# EAGLE design pcb_univ_3-(2-7)-(5-0)-x-rev3 (EAGLE 7.4.0)
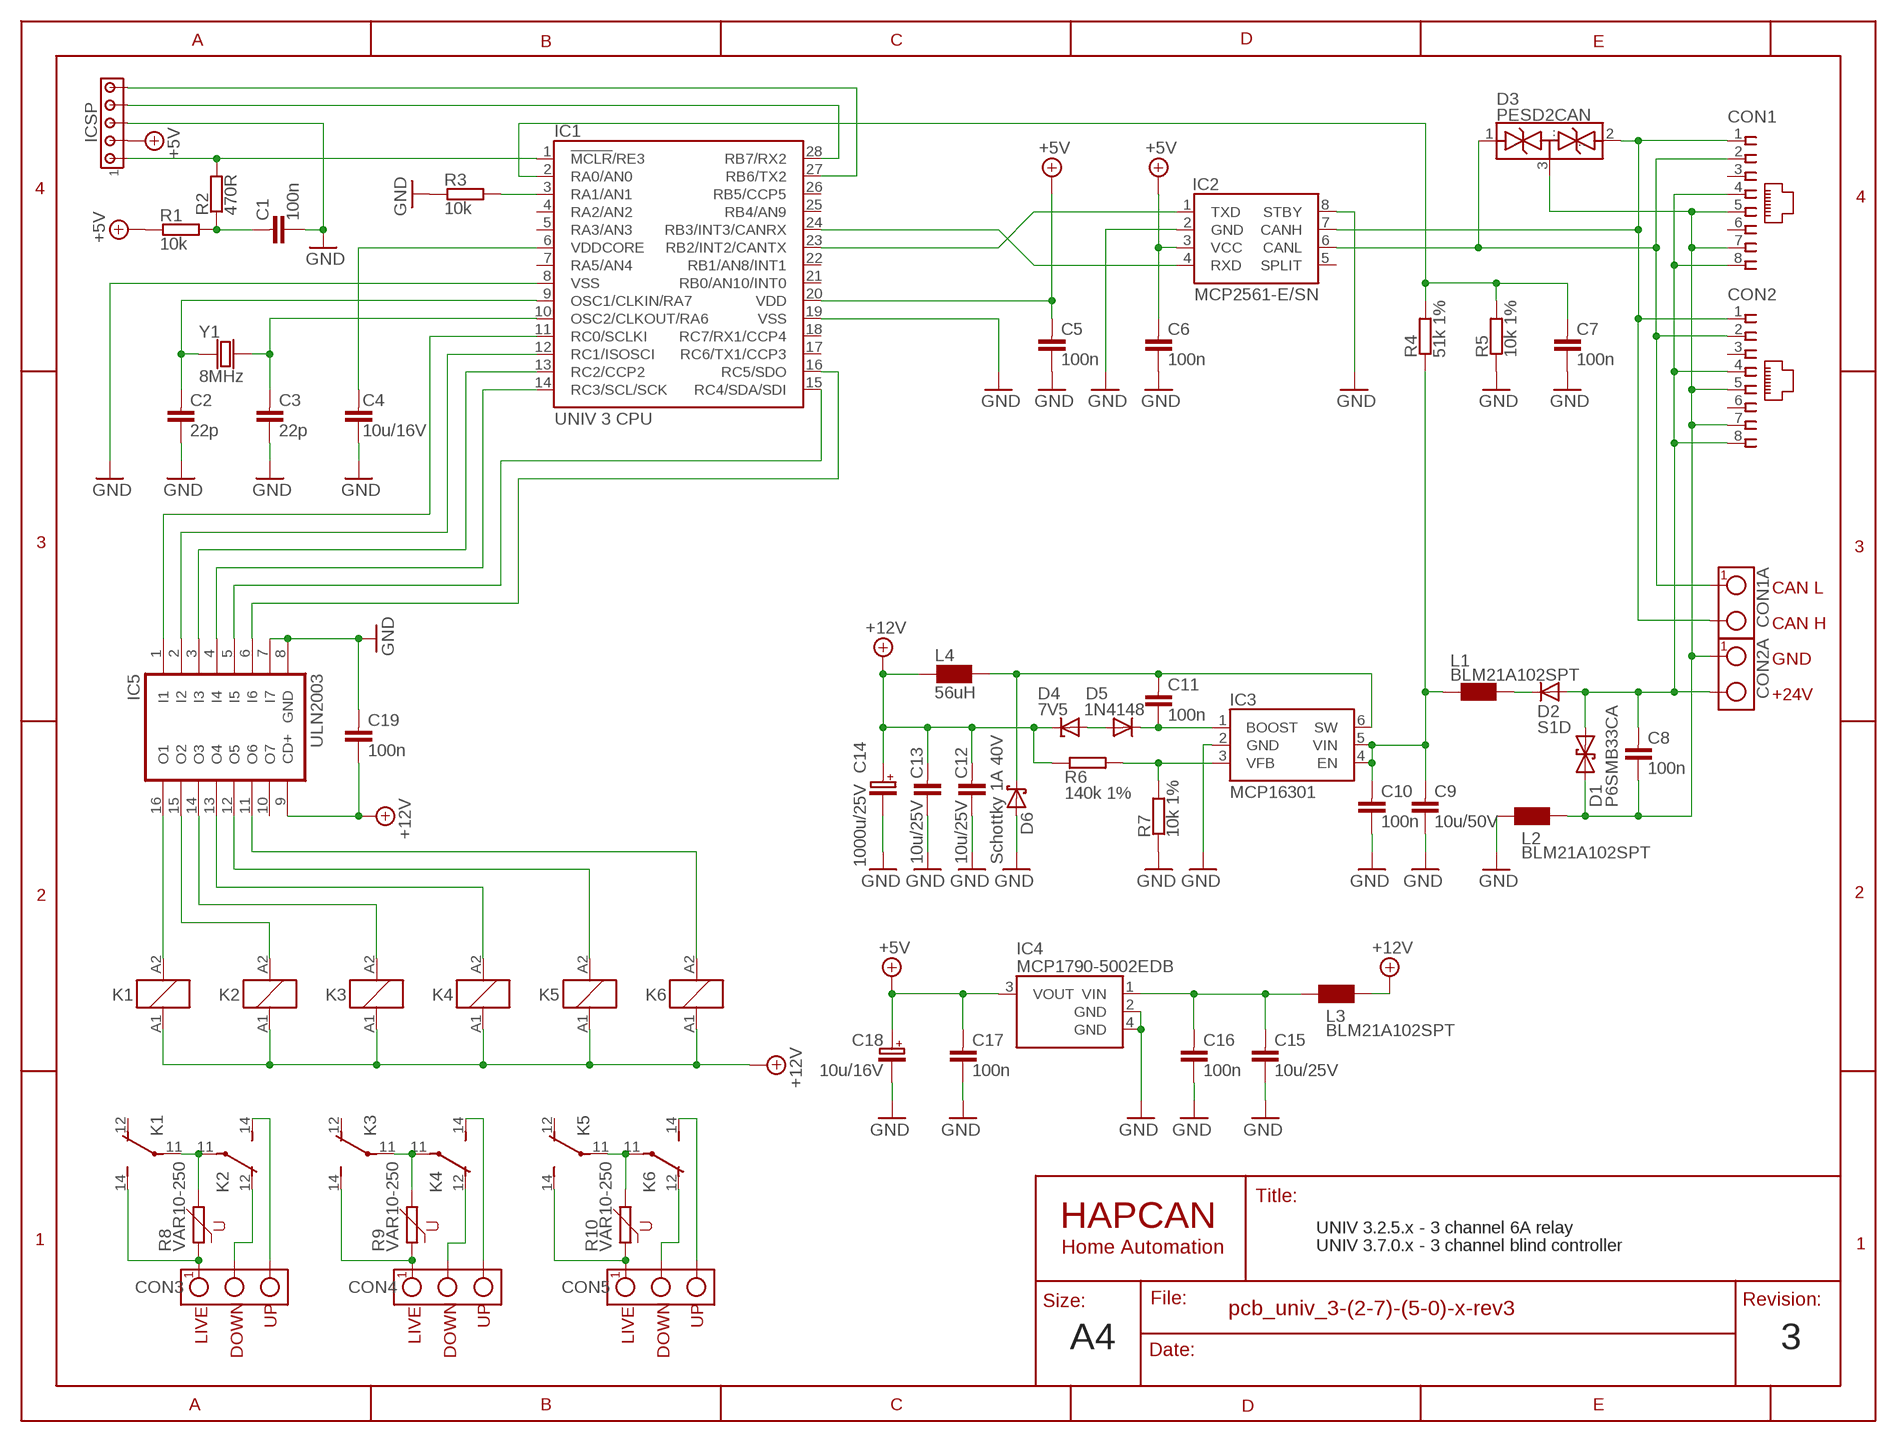
[diagram p0: schematic, sheet 1]
FRAME (HAP_A4): AUTHOR: hapcan.com

## Parts
C1  100n  CAPACITOR0805  [0805]
C2  22p  CAPACITOR0805  [0805]
C3  22p  CAPACITOR0805  [0805]
C4  10u/16V  CAPACITOR0805  [0805]
C5  100n  CAPACITOR0805  [0805]
C6  100n  CAPACITOR0805  [0805]
C7  100n  CAPACITOR0805  [0805]
C8  100n  CAPACITOR0805  [0805]
C9  10u/50V  CAPACITOR1210  [1210]
C10  100n  CAPACITOR0805  [0805]
C11  100n  CAPACITOR0805  [0805]
C12  10u/25V  CAPACITOR1206  [1206]
C13  10u/25V  CAPACITOR1206  [1206]
C14  1000u/25V  CAPACITOR-POLARIZED-5X10.5  [CAP-5X10.5]
C15  10u/25V  CAPACITOR1206  [1206]
C16  100n  CAPACITOR0805  [0805]
C17  100n  CAPACITOR0805  [0805]
C18  10u/16V  CAPACITOR-POLARIZED-SMC_B  [SMC_B]
C19  100n  CAPACITOR0805  [0805]
CON1  RJ45-SOCKET  [RJ45-PCB-SOCKET]
CON1A  TERMINAL-2  TERMINAL-2-5X10,5MM  [ARK2-5X10,5MM]
CON2  RJ45-SOCKET  [RJ45-PCB-SOCKET]
CON2A  TERMINAL-2  TERMINAL-2-5X10,5MM  [ARK2-5X10,5MM]
CON3  TERMINAL-3-5X10.5MM  [ARK3-5X10.5MM]
CON4  TERMINAL-3-5X10.5MM  [ARK3-5X10.5MM]
CON5  TERMINAL-3-5X10.5MM  [ARK3-5X10.5MM]
D1  P6SMB33CA  DIODE_TRANSIL2  [DO-214_TRANSIL2]
D2  S1D  DIODE_DO-214  [DO-214]
D3  PESD2CAN  PESD2CANSOT-23  [SOT-23]
D4  7V5  DIODE_ZENER_SOD-80  [SOD-80]
D5  1N4148  DIODE_0805  [0805]
D6  Schottky 1A 40V  DIODE_TRANSIL1_DO214  [DO-214]
IC1  UNIV 3 CPU  UNIV3CPU-I/SO  [UNIV3CPU]
IC2  MCP2561-E/SN  [SO-08]
IC3  MCP16301  MCP16301SOT23-6  [SOT-23-6]
IC4  MCP1790-5002EDB  MCP1826SOT223-3  [SOT-223]
IC5  ULN2003  [SO-16]
ICSP  HEADER5  [SIP-5]
K1  RELAY_SNR_SPDTV  [RELAY_SNR_SPDT_V]
K2  RELAY_SNR_SPDTV  [RELAY_SNR_SPDT_V]
K3  RELAY_SNR_SPDTV  [RELAY_SNR_SPDT_V]
K4  RELAY_SNR_SPDTV  [RELAY_SNR_SPDT_V]
K5  RELAY_SNR_SPDTV  [RELAY_SNR_SPDT_V]
K6  RELAY_SNR_SPDTV  [RELAY_SNR_SPDT_V]
L1  BLM21A102SPT  CHOKE0805  [0805]
L2  BLM21A102SPT  CHOKE0805  [0805]
L3  BLM21A102SPT  CHOKE0805  [0805]
L4  56uH  CHOKEDER0705  [CHOKE-DER0705]
R1  10k  RESISTOR0805  [0805]
R2  470R  RESISTOR0805  [0805]
R3  10k  RESISTOR0805  [0805]
R4  51k 1%  RESISTOR0805  [0805]
R5  10k 1%  RESISTOR0805  [0805]
R6  140k 1%  RESISTOR0805  [0805]
R7  10k 1%  RESISTOR0805  [0805]
R8  VAR10-250  VARISTOR7.5MM-1  [VARISTOR1]
R9  VAR10-250  VARISTOR7.5MM-1  [VARISTOR1]
R10  VAR10-250  VARISTOR7.5MM-1  [VARISTOR1]
Y1  8MHz  CRYSTAL-HC49V  [CRYSTAL-HC49V]

## Nets
+5V: C5.1 C6.1 C17.1 C18.+ IC1.20(VDD) IC2.3(VCC) IC4.3(VOUT) ICSP.2 R1.1
+12V: C12.1 C13.1 C14.+ C19.2 D4.C IC5.9(CD+) K1.A1 K2.A1 K3.A1 K4.A1 K5.A1 K6.A1 L3.2 L4.1 R6.1
GND: C1.2 C2.2 C3.2 C4.2 C5.2 C6.2 C7.2 C9.2 C10.2 C12.2 C13.2 C14.- C15.2 C16.2 C17.2 C18.- C19.1 D6.A IC1.8(VSS) IC1.19(VSS) IC2.2(GND) IC2.8(STBY) IC3.2(GND) IC4.2(GND) IC4.4(GND) IC5.7(I7) IC5.8(GND) ICSP.3 L2.1 R3.1 R5.1 R7.1
N$1: D2.C L1.2
N$2: IC1.24(RB3/INT3/CANRX) IC2.4(RXD)
N$3: IC1.23(RB2/INT2/CANTX) IC2.1(TXD)
N$4: CON1.1 CON1A.2 CON2.1 D3.2(..) IC2.7(CANH)
N$5: C9.1 C10.1 IC3.4(EN) IC3.5(VIN) L1.1 R4.1
N$6: C15.1 C16.1 IC4.1(VIN) L3.1
N$7: C1.1 R1.2 R2.1
N$8: IC1.1(!MCLR!/RE3) ICSP.1 R2.2
N$9: C8.1 CON1.4 CON1.8 CON2.4 CON2.8 CON2A.2 D1.C D2.A
N$10: IC1.28(RB7/RX2) ICSP.4
N$11: IC1.12(RC1/ISOSCI) IC5.2(I2)
N$12: IC1.3(RA1/AN1) R3.2
N$13: C8.2 CON1.5 CON1.7 CON2.5 CON2.7 CON2A.1 D1.A D3.3(...) L2.2
N$14: IC1.27(RB6/TX2) ICSP.5
N$15: C3.1 IC1.10(OSC2/CLKOUT/RA6) Y1.2
N$16: C7.1 IC1.2(RA0/AN0) R4.2 R5.2
N$17: C11.1 D6.C IC3.6(SW) L4.2
N$18: IC1.11(RC0/SCLKI) IC5.1(I1)
N$19: IC1.13(RC2/CCP2) IC5.3(I3)
N$20: IC3.3(VFB) R6.2 R7.2
N$21: IC5.16(O1) K1.A2
N$22: IC1.14(RC3/SCL/SCK) IC5.4(I4)
N$23: D4.A D5.2(A)
N$24: IC1.15(RC4/SDA/SDI) IC5.5(I5)
N$25: IC5.15(O2) K2.A2
N$26: IC5.14(O3) K3.A2
N$27: CON1.2 CON1A.1 CON2.2 D3.1(.) IC2.6(CANL)
N$28: IC5.13(O4) K4.A2
N$29: IC5.12(O5) K5.A2
N$30: CON3.1 K1.14(NO) R8.1
N$31: IC5.11(O6) K6.A2
N$32: K1.11(COM) K2.11(COM) R8.2
N$33: CON3.3 K2.14(NO)
N$34: CON3.2 K2.12(NC)
N$35: K3.11(COM) K4.11(COM) R9.2
N$37: CON4.2 K4.12(NC)
N$38: C11.2 D5.1(C) IC3.1(BOOST)
N$39: CON4.3 K4.14(NO)
N$40: C2.1 IC1.9(OSC1/CLKIN/RA7) Y1.1
N$42: CON5.2 K6.12(NC)
N$43: CON5.3 K6.14(NO)
N$45: IC1.16(RC5/SDO) IC5.6(I6)
N$54: K5.11(COM) K6.11(COM) R10.2
N$56: C4.1 IC1.6(VDDCORE)
N$58: CON4.1 K3.14(NO) R9.1
N$60: CON5.1 K5.14(NO) R10.1
Unconnected: CON1.3 CON1.6 CON2.3 CON2.6 IC1.4(RA2/AN2) IC1.5(RA3/AN3) IC1.7(RA5/AN4) IC1.17(RC6/TX1/CCP3) IC1.18(RC7/RX1/CCP4) IC1.21(RB0/AN10/INT0) IC1.22(RB1/AN8/INT1) IC1.25(RB4/AN9) IC1.26(RB5/CCP5) IC2.5(SPLIT) IC5.10(O7) K1.12(NC) K3.12(NC) K5.12(NC)

## Notes on the sheet
- CAN L
- CAN H
- GND
- +24V
- UNIV 3.2.5.x - 3 channel 6A relay
- UNIV 3.7.0.x - 3 channel blind controller
- UP | UP | UP
- LIVE | LIVE | LIVE
- A4 | 3
- DOWN | DOWN | DOWN

## Library data of the parts
C1-C13 C15-C17 C19 = HAPCAN_devices - UNIV3:CAPACITOR: HAPCAN Capacitor
C14 C18 = HAPCAN_devices - UNIV3:CAPACITOR-POLARIZED: HAPCAN Polarazied Capacitor
CON1 CON2 = HAPCAN_devices - UNIV3:RJ45-SOCKET: HAPCAN RJ45 socket
CON1A CON2A = HAPCAN_devices - UNIV3:TERMINAL-2: HAPCAN Terminal Block - 2 way
CON3-CON5 = HAPCAN_devices - UNIV3:TERMINAL-3: HAPCAN Terminal Block - 3 way
D1 = HAPCAN_devices - UNIV3:DIODE_TRANSIL2: HAPCAN Bidirectional transil diode
D2 D5 = HAPCAN_devices - UNIV3:DIODE: HAPCAN Rectifier Diode
D3 = HAPCAN_devices - UNIV3:PESD2CAN: CAN bus ESD protection diode
D4 = HAPCAN_devices - UNIV3:DIODE_ZENER: HAPCAN ZENER DIODE
D6 = HAPCAN_devices - UNIV3:DIODE_TRANSIL1: HAPCAN Unidirectional transil diode
IC1 = HAPCAN_devices - UNIV3:UNIV3CPU: HAPCAN Microcontroller UNIV 3 CPU
IC2 = HAPCAN_devices - UNIV3:MCP2561: HAPCAN CAN Tranceiver
IC3 = HAPCAN_devices - UNIV3:MCP16301: High Voltage Input Integrated Switch Step-Down Regulator
IC4 = HAPCAN_devices - UNIV3:MCP1826: 1000 mA, Low Voltage, Low Quiescent Current LDO Regulator
IC5 = HAPCAN_devices - UNIV3:ULN2003: HAPCAN 7 channel Darlington Array NPN 50V 0.5A
ICSP = HAPCAN_devices - UNIV3:HEADER5: HAPCAN Header 5
K1-K6 = HAPCAN_devices - UNIV3:RELAY_SNR_SPDT: HAPCAN Slim PCB Relay 6 A - SPDT (single pole, double throw)
L1-L4 = HAPCAN_devices - UNIV3:CHOKE: Choke
R1-R7 = HAPCAN_devices - UNIV3:RESISTOR: HAPCAN Resistor
R8-R10 = HAPCAN_devices - UNIV3:VARISTOR: HAPCAN Varistor
Y1 = HAPCAN_devices - UNIV3:CRYSTAL: HAPCAN Crystal

## Board
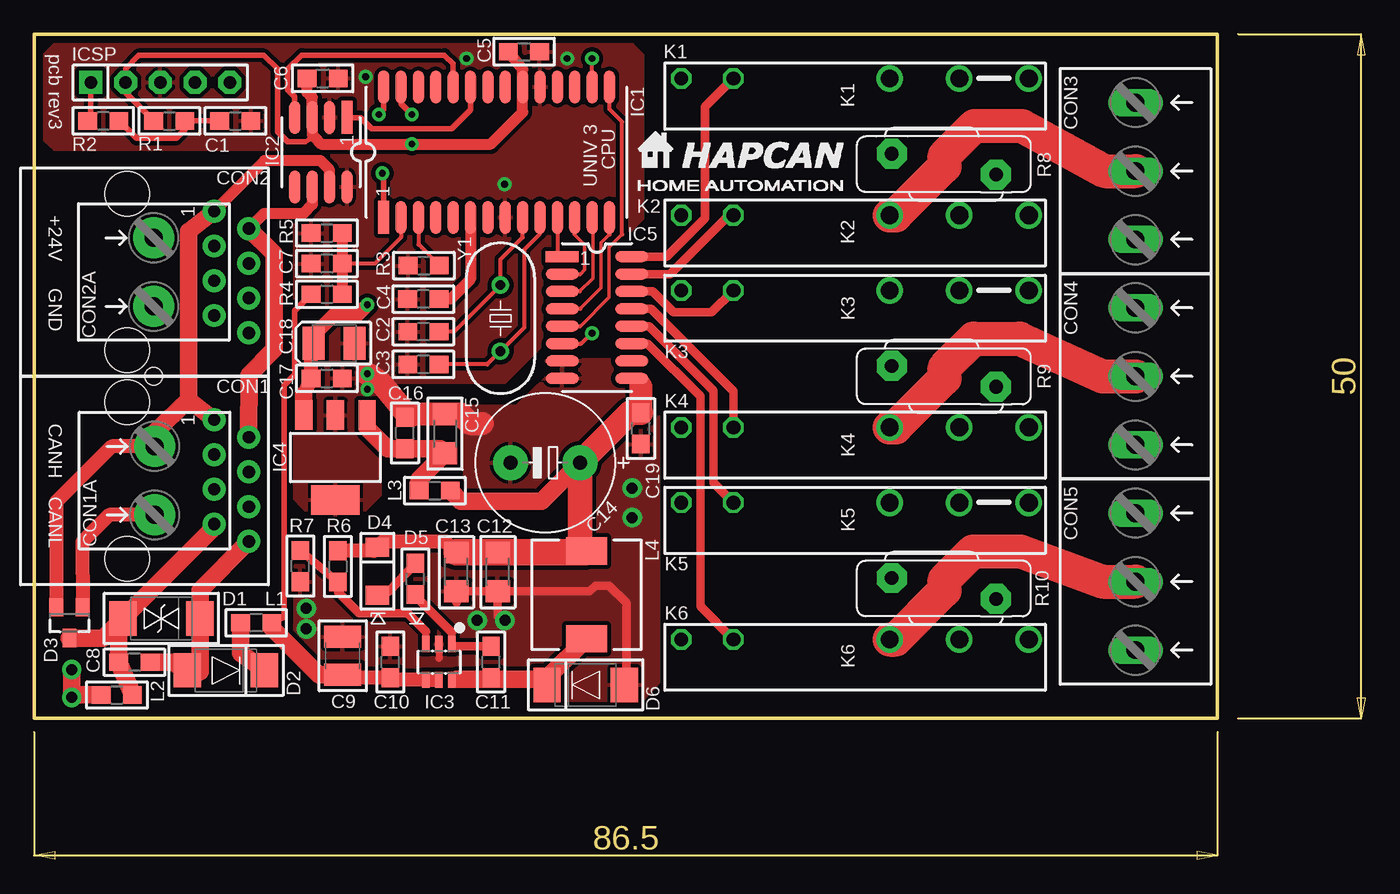
[diagram p1: board, top side]
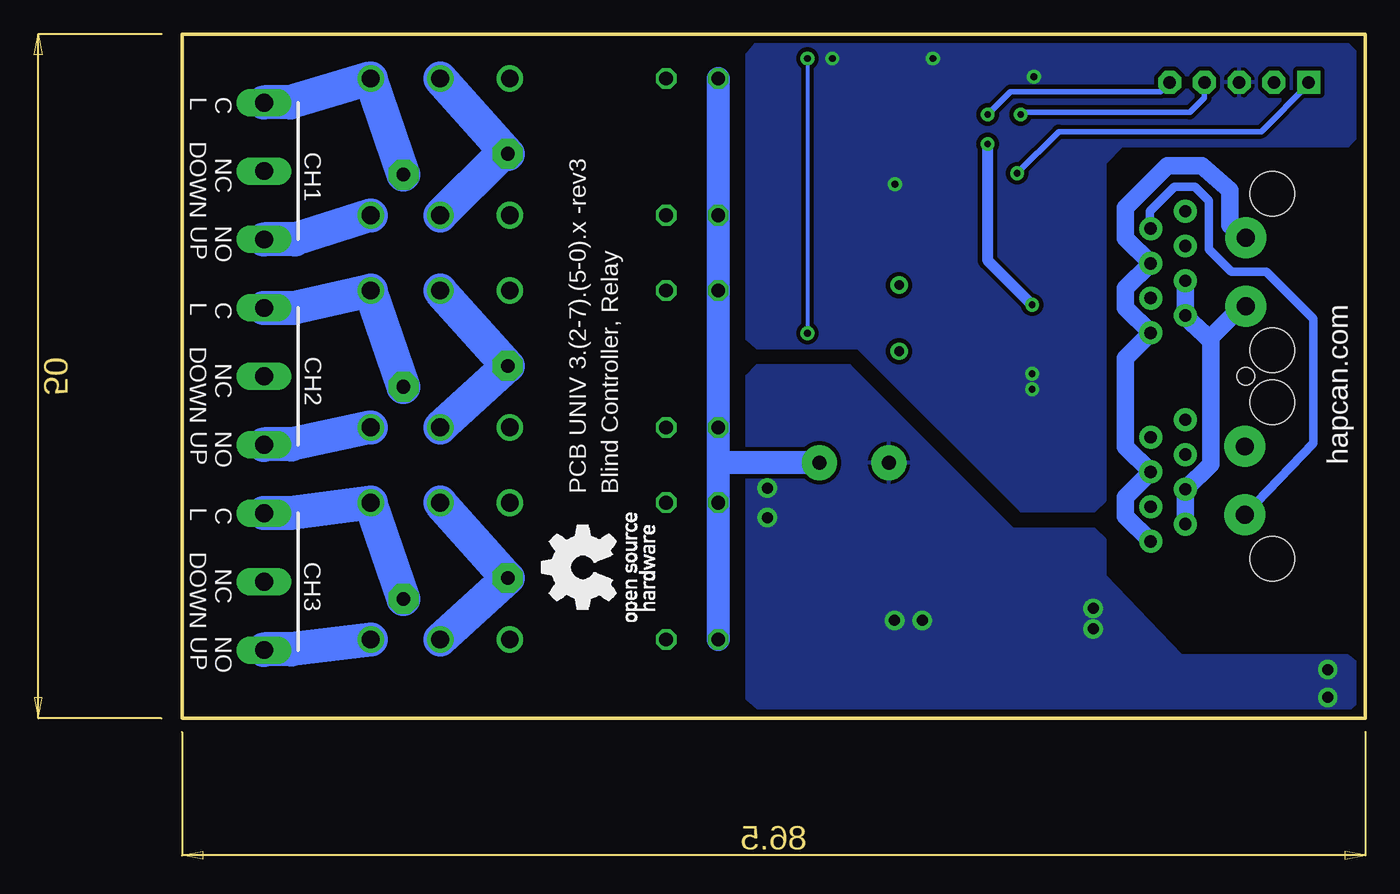
[diagram p2: board, bottom side, seen from below]

Size 86.5 x 50 mm. Coordinates in mm from the lower left corner, seen from the top.
Outline: 0,50 0,0 86.5,0 86.5,50 0,50
Copper layers (1*16): Top 0.035mm / dielectric 1.5mm / Bottom 0.035mm
Design rules "hapcan_drc *": minimum track width 10mil, minimum drill 0.5mm, track to track 12mil, track to pad 12mil, pad to pad 12mil, via to via 12mil, smd to smd 12mil, copper to edge 20mil, drill to drill 10mil, minimum pad ring 10mil, minimum via ring 10mil, stop-mask expansion 4mil, vias tented up to drill 0mil, thermal gap 10mil
Holes 1.3 mm at 8.74,25
tKeepout: 20 lines

### Footprints (pad centres in the part's own frame; a part is rotated, then mirrored left to right if it is on the bottom)
0805 = smd 1.372 x 1.27: 1 -1.143,0; 2 1.143,0
1210 = smd 1.6 x 2.7: 1 -1.4,0; 2 1.4,0
1206 = smd 1.6 x 1.803: 1 -1.422,0; 2 1.422,0
CAP-5X10.5 = drill 1 pad 2.54: + -2.54,0; - 2.54,0
SMC_B = smd 1.6 x 2.4: + -1.5,0; - 1.5,0
RJ45-PCB-SOCKET = drill 0.9 pad 1.676: 1 -4.445,6.35; 2 -3.175,8.89; 3 -1.905,6.35; 4 -0.635,8.89; 5 0.635,6.35; 6 1.905,8.89; 7 3.175,6.35; 8 4.445,8.89 | hole 3.251: -5.715,0; 5.715,0
ARK2-5X10,5MM = drill 1.3 pad 3: 1 -2.5,0; 2 2.5,0
ARK3-5X10.5MM = drill 1.3 pad 2 long: 1 -5,0; 2 0,0; 3 5,0
DO-214_TRANSIL2 = smd 2 x 2.5: A 2.82,0; C -2.82,0
DO-214 = smd 2 x 2.5: A 2.82,0; C -2.82,0
SOT-23 = smd 1.016 x 1.321: 1 -0.965,-1.118; 2 0.965,-1.118; 3 0,1.118
SOD-80 = smd 1.4 x 1.7: A 1.75,0; C -1.75,0
UNIV3CPU = smd 2.4 x 0.8: 1 -4.763,8.255; 2 -4.763,6.985; 3 -4.763,5.715; 4 -4.763,4.445; 5 -4.763,3.175; 6 -4.763,1.905; 7 -4.763,0.635; 8 -4.763,-0.635; 9 -4.763,-1.905; 10 -4.763,-3.175; 11 -4.763,-4.445; 12 -4.763,-5.715; 13 -4.763,-6.985; 14 -4.763,-8.255; 15 4.763,-8.255; 16 4.763,-6.985; 17 4.763,-5.715; 18 4.763,-4.445; 19 4.763,-3.175; 20 4.763,-1.905; 21 4.763,-0.635; 22 4.763,0.635; 23 4.763,1.905; 24 4.763,3.175; 25 4.763,4.445; 26 4.763,5.715; 27 4.763,6.985; 28 4.763,8.255
SO-08 = smd 2.4 x 0.8: 1 -2.54,1.905; 2 -2.54,0.635; 3 -2.54,-0.635; 4 -2.54,-1.905; 5 2.54,-1.905; 6 2.54,-0.635; 7 2.54,0.635; 8 2.54,1.905
SOT-23-6 = smd 0.55 x 1.2: 1 -0.95,-1.3; 2 0,-1.3; 3 0.95,-1.3; 4 0.95,1.3; 5 0.003,1.3; 6 -0.95,1.3
SOT-223 = smd 1.27 x 2.159: 1 -2.311,-3.099; 2 0,-3.099; 3 2.311,-3.099 | smd 3.556 x 2.159: 4 0,3.099
SO-16 = smd 2.4 x 0.8: 1 -2.54,4.445; 2 -2.54,3.175; 3 -2.54,1.905; 4 -2.54,0.635; 5 -2.54,-0.635; 6 -2.54,-1.905; 7 -2.54,-3.175; 8 -2.54,-4.445; 9 2.54,-4.445; 10 2.54,-3.175; 11 2.54,-1.905; 12 2.54,-0.635; 13 2.54,0.635; 14 2.54,1.905; 15 2.54,3.175; 16 2.54,4.445
SIP-5 = drill 0.9 pad 1.676 square: 1 -5.08,0 | drill 0.9 pad 1.676 octagon: 2 -2.54,0; 3 0,0; 4 2.54,0; 5 5.08,0
RELAY_SNR_SPDT_V = drill 1.3: 11 7.62,1.27; 12 2.54,1.27; 14 12.7,1.27 | drill 1 octagon: A1 -12.7,1.27; A2 -8.89,1.27
CHOKE-DER0705 = smd 2 x 3: 1 -3.2,0; 2 3.2,0
VARISTOR1 = drill 1 pad 2.184 octagon: 1 -0.762,-3.81; 2 0.762,3.81
CRYSTAL-HC49V = drill 0.7 pad 1.27: 1 -2.413,0; 2 2.413,0

### Placement (x,y rotation side)
C1  14.71,43.66 0 top
C2  28.45,28.26 180 top
C3  28.45,25.87 180 top
C4  28.45,30.65 180 top
C5  35.81,48.72 0 top
C6  21.09,46.77 0 top
C7  21.39,33.24 180 top
C8  7.33,4.11 180 top
C9  22.56,4.58 90 top
C10  26.03,4.13 90 top
C11  33.4,4.13 90 top
C12  33.88,10.71 270 top
C13  30.86,10.71 270 top
C14  37.36,18.69 180 top
C15  30.03,20.81 90 top
C16  27.11,20.86 90 top
C17  21.39,24.85 0 top
C18  21.93,27.42 0 top
C19  44.35,21.2 90 top
CON1  6.8,17.38 270 top
CON1A  8.8,17.38 90 top
CON2  6.8,32.62 270 top
CON2A  8.74,32.62 90 top
CON3  80.5,40 270 top
CON4  80.5,25 270 top
CON5  80.5,10 270 top
D1  9.3,7.3 180 top
D2  14.02,3.52 180 top
D3  2.58,7 180 top
D4  25.09,10.76 270 top
D5  27.86,10.2 90 top
D6  40.31,2.45 0 top
IC1  33.8,41.38 90 top
IC2  20.96,41.38 270 top
IC3  29.59,4.13 180 top
IC4  22.02,19.07 180 top
IC5  41.13,29.3 0 top
ICSP  9.22,46.48 0 top
K1  60,45.5 0 top
K2  60,35.5 0 top
K3  60,30 0 top
K4  60,20 0 top
K5  60,14.5 0 top
K6  60,4.5 0 top
L1  16.23,7 180 top
L2  6.05,1.72 0 top
L3  29.28,16.65 0 top
L4  40.36,9.03 270 top
R1  9.88,43.66 0 top
R2  5.05,43.66 180 top
R3  28.48,33.09 0 top
R4  21.39,31 0 top
R5  21.39,35.47 0 top
R6  22.2,11.11 270 top
R7  19.45,11.14 90 top
R8  66.5,40.5 90 top
R9  66.5,25 90 top
R10  66.5,9.5 90 top
Y1  34.09,29.25 270 top

### Tracks (layer width: path | path; a pad name or v marks a point on that pad's centre or on a via)
+5V  (via drill 0.5)
  Top 0.406: R1.1 6.68,45.72 ICSP.2 6.68,47.49 7.64,48.45 16.79,48.45 17.78,47.46 17.78,42.89 18.54,42.13 19.81,42.13 20.45,42.51
  Top 0.813: C5.1 35.7,47.43 IC1.20 35.7,44.3 33.38,41.97 v27.61,41.97 20.98,41.97 20.45,42.51 20.32,42.63 IC2.3 20.32,45.37 19.94,45.75 C6.1
  Top 1.016: 19.71,23.67 C17.1 20.24,26.72 | 20.43,28.02 21.89,29.48 23.6,29.48 v24.36,30.24
  Top 1.27: 19.71,23.67 IC4.3 | 20.24,26.72 C18.+ | C18.+ 20.37,27.23 | C18.+ 20.43,28.02
  Bottom 0.813: v27.61,41.97 27.61,33.49 v24.36,30.24
+12V
  Top 0.305: IC5.9 44.35,24.79
  Top 0.813: 44.32,24.24 44.32,24.77 44.35,24.79
  Top 1.016: C13.1 30.07,12.92 25.5,12.92 D4.C 24.84,12.26 R6.1
  Top 1.27: L3.2 31.18,15.88 37.09,15.88 C14.+
  Top 1.676: C19.2 44.35,24.22 44.32,24.24
  Top 1.778: C19.2 43.55,22.34 C14.+ 39.9,12.69 L4.1
  Top 1.93: C13.1 C12.1 40.26,12.13 L4.1
  Bottom 1.676: K1.A1 K2.A1 K3.A1 K4.A1 47.3,19.01 | 47.3,19.01 K5.A1 K6.A1 | 47.3,19.01 47.23,18.69 C14.+
GND  (via drill 0.5, 0.8 pad 1.42)
  Top 0.406: C1.2 15.85,43.51
  Top 0.508: IC3.2 29.59,4.38
  Top 0.61: C12.2 C13.2 30.86,8.45 | D6.A 43.31,3.14 43.31,8.45 42.04,9.72 41.02,9.72 40.59,9.28 C12.2 | v34.42,7.18 33.88,7.46 C12.2
  Top 1.016: 27.69,22.19 27.11,22.19 C16.2 27.11,22.39
  Top 1.27: v2.74,3.57 v2.74,1.53 2.92,1.72 L2.1
  Top 1.676: C14.- 34.74,18.69 | 27.11,22.39 25.45,24.42 v24.36,25.18 | 27.69,22.19 27.69,22.23 C15.2 31.2,22.23 31.88,21.55 32.77,21.55
  other vias: 19.89,6.54 32.38,7.18 19.89,8.04 43.71,14.67 38.96,48.22 34.39,39.03 24.23,46.9 43.71,16.83 24.36,24.07 31.6,48.22
  pour Top (isolate 0.305): 44.07,26.23 arc-90 45.59,24.96 45.59,2.6 44.39,1.33 20.7,1.33 arc-90 19.02,3.31 19.18,13.02 31.5,12.92 31.5,22.82 35.31,22.82 37.47,24.88 37.49,26.23
  pour Top: 42.93,50 2.25,50 0,47.75 0,43 1.5,41.62 19.05,41.62 19.05,16.09 20.12,14.92 23.85,14.92 25.27,16.34 25.27,24.6 34.42,24.6 37.08,27.27 37.08,33.74 38.1,35.01 42.93,35.01 44.45,36.54 44.45,48.48
  pour Bottom: 0,3.52 1.27,4.53 13.46,4.53 19.05,10.38 19.05,13.04 19.81,13.8 25.76,13.8 37.69,25.74 44.45,25.74 45.21,24.98 45.21,1.49 43.43,-0.04 2.03,-0.04 0,1.74
  pour Bottom: 45.21,48.48 45.21,27.77 44.45,27.14 37.08,27.14 25.15,15.2 19.81,15.2 19.05,15.96 19.05,40.6 17.78,41.87 1.27,41.87 0,43.14 0,47.97 2.03,50 43.94,50
N$1
  Top 1.27: L1.2 15.09,4.76 D2.C
N$2
  Top 0.406: IC2.4 19.05,45.42 18.54,45.94 18.54,47.46 19.56,48.48 29.97,48.48 30.62,47.83 IC1.24
N$3
  Top 0.406: IC1.23 31.89,44.48 30.5,43.09 24.66,43.09 23.85,43.9 22.88,43.9 IC2.1
N$4
  Top 0.813: IC2.7 21.59,40.09 20.93,40.75 16.84,40.75 CON2.1
  Top 1.016: CON1A.2 5.67,19.88 1.63,15.84 D3.2
  Top 1.27: 11.3,23.29 CON1.1 | 11.3,23.29 11.3,35.6 CON2.1 | 11.3,23.29 8.8,20.92 CON1A.2
N$5
  Top 0.305: 29.3,2.83 IC3.5
  Top 0.406: R4.1 19.05,29.81 19.05,25.11 18.29,24.35 18.29,7.4 L1.1
  Top 1.016: C10.1 26.11,2.9 | 22.73,3.01 C9.1 22.75,2.98 C10.1 | C10.1 26.19,2.83 IC3.4 29.3,2.83
  Top 1.27: L1.1 17.37,6.62 20.81,3.19 C9.1
N$6
  Top 1.27: IC4.1 24.33,21.22 25.84,19.72 C16.1 29.7,19.72 C15.1 28.14,17.5 L3.1
N$7
  Top 0.305: 11.02,43.04 R1.2
  Top 0.406: R2.1 7.48,42.38 10.36,42.38 11.02,43.04 | R1.2 C1.1
N$8  (via drill 0.5)
  Top 0.406: ICSP.1 4.14,43.89 R2.2 | IC1.1 25.54,39.75 v25.45,39.84
  Bottom 0.406: v25.45,39.84 22.4,42.89 7.62,42.89 4.14,46.37 ICSP.1
N$9
  Top 1.27: CON1.8 12.12,9.36 D1.C 12.12,3.42 D2.A 10.1,4.11 C8.1
  Bottom 1.27: CON1.8 17.53,14.77 17.53,16.18 CON1.4 17.53,19.85 17.53,26.34 CON2.8 17.53,30.01 17.53,31.42 CON2.4 17.53,35.09 17.53,37.32 14.48,40.37 11.94,40.37 9.91,38.59 9.91,36.03 CON2A.2
N$10  (via drill 0.5)
  Top 0.406: IC1.28 25.54,44.48 v25.2,44.13
  Bottom 0.406: v25.2,44.13 25.04,44.28 12.83,44.28 11.76,45.35 ICSP.4
N$11
  Top 0.254: 39.93,32.48 40.23,32.78 40.23,34.63 39.51,35.36
  Top 0.305: IC5.2 39.93,32.48 | 39.51,35.36 39.51,35.79
  Top 0.406: IC1.12 39.51,35.79
N$12
  Top 0.305: IC1.3 28.08,34.64 R3.2
N$13
  Top 1.27: D3.3 5.05,5.88 D1.A | D1.A 6.19,7.01 C8.2 L2.2 | CON1.7 13.15,13.97 D1.A
  Bottom 1.016: 11.43,27.73 11.3,27.65 | 13.15,29.37 CON2.7
  Bottom 1.27: CON2A.1 9.25,29.91 11.43,27.73 | CON2.7 CON2.5 | 13.15,29.37 11.3,27.65 11.3,18.59 CON1.5 CON1.7
N$14  (via drill 0.5)
  Top 0.406: IC1.27 26.81,44.93 v27.61,44.13
  Bottom 0.406: ICSP.5 14.97,45.81 25.93,45.81 v27.61,44.13
N$15
  Top 0.305: C3.1 33.12,25.87 Y1.2 35.81,28.56 35.81,34.25 36.97,35.41 IC1.10
N$16
  Top 0.305: R4.2 22.44,30.81 | IC1.2 26.81,35.16 24.89,33.24 C7.1
  Top 0.813: R4.2 C7.1 R5.2
N$17
  Top 0.508: 30.91,2.86 30.57,2.86 IC3.6
  Top 0.61: 33.2,2.96 C11.1 | D6.C 37.13,3.31
  Top 1.27: L4.2 37.49,2.96 D6.C 37.08,2.86 33.3,2.86 33.2,2.96 | C11.1 33.27,2.86 30.91,2.86
N$18
  Top 0.305: IC1.11 38.24,33.75
  Top 0.406: 38.24,33.75 IC5.1
N$19
  Top 0.254: 39.88,31.21 40.84,32.17 40.84,36.62
  Top 0.305: 39.88,31.21 IC5.3 | 40.84,36.62 IC1.13
N$20
  Top 0.508: IC3.3 28.64,6.35
  Top 0.61: R7.2 R6.2 22.2,9.23 23.75,7.68 27.3,7.68 28.64,6.35
N$21
  Top 0.61: IC5.16 46.23,33.75 49.02,36.54 49.02,44.68 K1.A2
N$22
  Top 0.254: 39.91,29.94 41.44,31.47 41.44,34.75 42.06,35.37
  Top 0.305: 39.91,29.94 IC5.4 | 42.06,35.37 42.06,36.61 IC1.14
N$23
  Top 0.61: D4.A 25.91,9.26 D5.2
N$24
  Top 0.254: 39.93,28.66 42.04,30.77 42.04,34.43 42.98,35.37
  Top 0.305: IC1.15 42.05,44.52 42.98,43.6 42.98,35.37 | IC5.5 39.93,28.67 39.93,28.66
N$25
  Top 0.61: IC5.15 46.48,32.48 50.78,36.77 K2.A2
N$26
  Top 0.61: IC5.14 45.21,31.21 46.74,29.68 49.52,29.68 K3.A2
N$27
  Top 0.813: IC2.6 20.32,37.56 19.66,36.89 16.79,36.89 CON2.2
  Top 1.016: D3.1 3.53,12.91 5.5,14.88 CON1A.1
  Top 1.27: CON2.2 17.53,33.96 17.53,26.96 15.7,25.13 CON1.2
  Bottom 0.61: CON1A.1 3.81,20.13 3.81,29.2 7.24,32.62 9.78,32.62 11.43,34.28 11.43,37.83 12.45,38.85 13.97,38.85 15.75,37.07 15.75,35.85 CON2.2
N$28
  Top 0.61: IC5.13 45.08,29.94 51.11,23.91 K4.A2
N$29
  Top 0.61: IC5.12 44.95,28.67 49.66,23.96 49.66,17.22 K5.A2
N$30
  Bottom 2.5: R8.1 K1.14 78.59,45.02 80.5,45.02 CON3.1
N$31
  Top 0.61: K6.A2 48.69,8.19 48.69,23.53 44.83,27.4 IC5.11
N$32
  Bottom 2: R8.2 63.19,41.2
  Bottom 2.5: K1.11 R8.2 | 63.19,41.2 K2.11
N$33
  Bottom 2.5: K2.14 78.23,35.01 80.5,35.01 CON3.3
N$34
  Top 2.5: CON3.2 78.28,40 72.19,43.29 68.73,43.29 66.55,41.11 66.55,40.35 62.97,36.77 K2.12
N$35
  Bottom 2.5: K3.11 R9.2 K4.11
N$37
  Top 2.5: CON4.2 78.09,25 72.03,27.75 68.68,27.75 66.55,25.62 66.55,24.85 62.96,21.27 K4.12
N$38
  Top 0.508: IC3.1 30.54,6.25
  Top 0.61: 27.86,8.78 D5.1 27.86,8.93 30.54,6.25 | IC3.1 30.7,5.27 C11.2
N$39
  Bottom 2.5: K4.14 78.49,20.03 80.5,20.03 CON4.3
N$40
  Top 0.305: C2.1 30.68,28.26 Y1.1 34.09,33.54 35.7,35.16 IC1.9
N$42
  Top 2.5: CON5.2 78.1,10 72.08,12.21 68.63,12.21 66.55,10.12 66.55,9.36 62.96,5.77 K6.12
N$43
  Bottom 2.5: K6.14 78.49,5.04 80.5,5.04 CON5.3
N$45  (via drill 0.5)
  Top 0.305: IC1.16 40.78,46 v40.77,48.22 | IC5.6 39.96,27.4 v40.77,28.16
  Bottom 0.305: v40.77,48.22 v40.77,28.16
N$54
  Bottom 2.5: K5.11 R10.2 K6.11
N$56
  Top 0.813: IC1.6 31.89,32.11 30.43,30.65 C4.1
N$58
  Bottom 2.5: R9.1 K3.14 78.36,29.98 80.5,29.98 CON4.1
N$60
  Bottom 2.5: R10.1 K5.14 78.54,15 CON5.1

### Text on the board
tPlace: pcb rev3 | K1 | +24V | K2 | GND | K3 | CANH | K4 | CANL | K5 | K6
bPlace: C | L | DOWN | CH1 | NC | NO | UP | C | L | DOWN | CH2 | NC | NO | UP | hapcan.com | Blind Controller, Relay | PCB UNIV 3.(2-7).(5-0).x -rev3 | C | L | DOWN | CH3 | NC | NO | UP